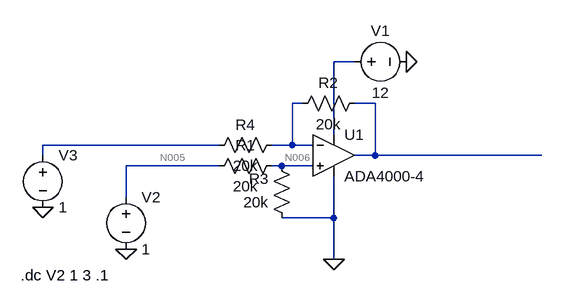
[diagram p0: schematic Draft1.asc]
Draft1.asc, the LTspice schematic file:
Version 4
SHEET 1 880 680
WIRE 208 16 176 16
WIRE 128 80 112 80
WIRE 240 80 208 80
WIRE 176 128 176 16
WIRE 0 144 -272 144
WIRE 112 144 112 80
WIRE 112 144 80 144
WIRE 144 144 112 144
WIRE -272 160 -272 144
WIRE 240 160 240 80
WIRE 240 160 208 160
WIRE 496 160 240 160
WIRE 0 176 -144 176
WIRE 96 176 80 176
WIRE 144 176 96 176
WIRE -144 224 -144 176
WIRE 176 256 176 192
WIRE 176 256 96 256
WIRE 176 320 176 256
FLAG 288 16 0
FLAG 176 320 0
FLAG -144 304 0
FLAG -272 240 0
SYMBOL OpAmps\\ADA4000-4 176 96 R0
SYMATTR InstName U1
SYMBOL voltage 192 16 R270
WINDOW 0 32 56 VTop 2
WINDOW 3 -32 56 VBottom 2
WINDOW 123 0 0 Left 0
WINDOW 39 0 0 Left 0
SYMATTR InstName V1
SYMATTR Value 12
SYMBOL voltage -144 208 R0
WINDOW 123 0 0 Left 0
WINDOW 39 0 0 Left 0
SYMATTR InstName V2
SYMATTR Value 1
SYMBOL voltage -272 144 R0
WINDOW 123 0 0 Left 0
WINDOW 39 0 0 Left 0
SYMATTR InstName V3
SYMATTR Value 1
SYMBOL res 96 160 R90
WINDOW 0 0 56 VBottom 2
WINDOW 3 32 56 VTop 2
SYMATTR InstName R1
SYMATTR Value 20k
SYMBOL res 112 272 R180
WINDOW 0 36 76 Left 2
WINDOW 3 36 40 Left 2
SYMATTR InstName R3
SYMATTR Value 20k
SYMBOL res 96 128 R90
WINDOW 0 0 56 VBottom 2
WINDOW 3 32 56 VTop 2
SYMATTR InstName R4
SYMATTR Value 20k
SYMBOL res 224 64 R90
WINDOW 0 0 56 VBottom 2
WINDOW 3 32 56 VTop 2
SYMATTR InstName R2
SYMATTR Value 20k
TEXT -306 344 Left 2 !.dc V2 1 3 .1

The netlist it stands for:
* Draft1.asc
XU1 N006 N002 N001 0 N003 ADA4000-4  ; pins In+ In- V+ V- OUT
V1 N001 0 12
V2 N005 0 1
V3 N004 0 1
R1 N006 N005 20k
R3 0 N006 20k
R4 N002 N004 20k
R2 N003 N002 20k
.dc V2 1 3 .1
.backanno
.end

* Results of the author's LTspice run, read from the files saved beside the schematic
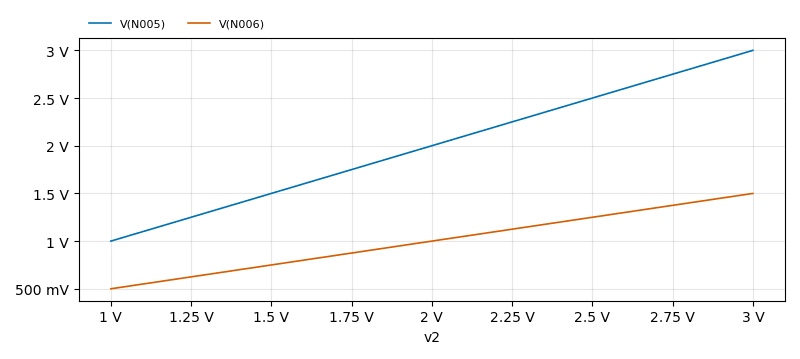
[diagram p1: DC transfer characteristic of Draft1.asc, plotted from the saved traces]
* DC transfer characteristic, 1 run:
*   V(N005): 1 V at v2=1 V, 3 V at v2=3 V, min 1 V, max 3 V
*   V(N006): 500 mV at v2=1 V, 1.5 V at v2=3 V, min 500 mV, max 1.5 V